# EasyEDA Pro project ProPrj_Syndra Version 2_2026-02-07.epro, board PCB2
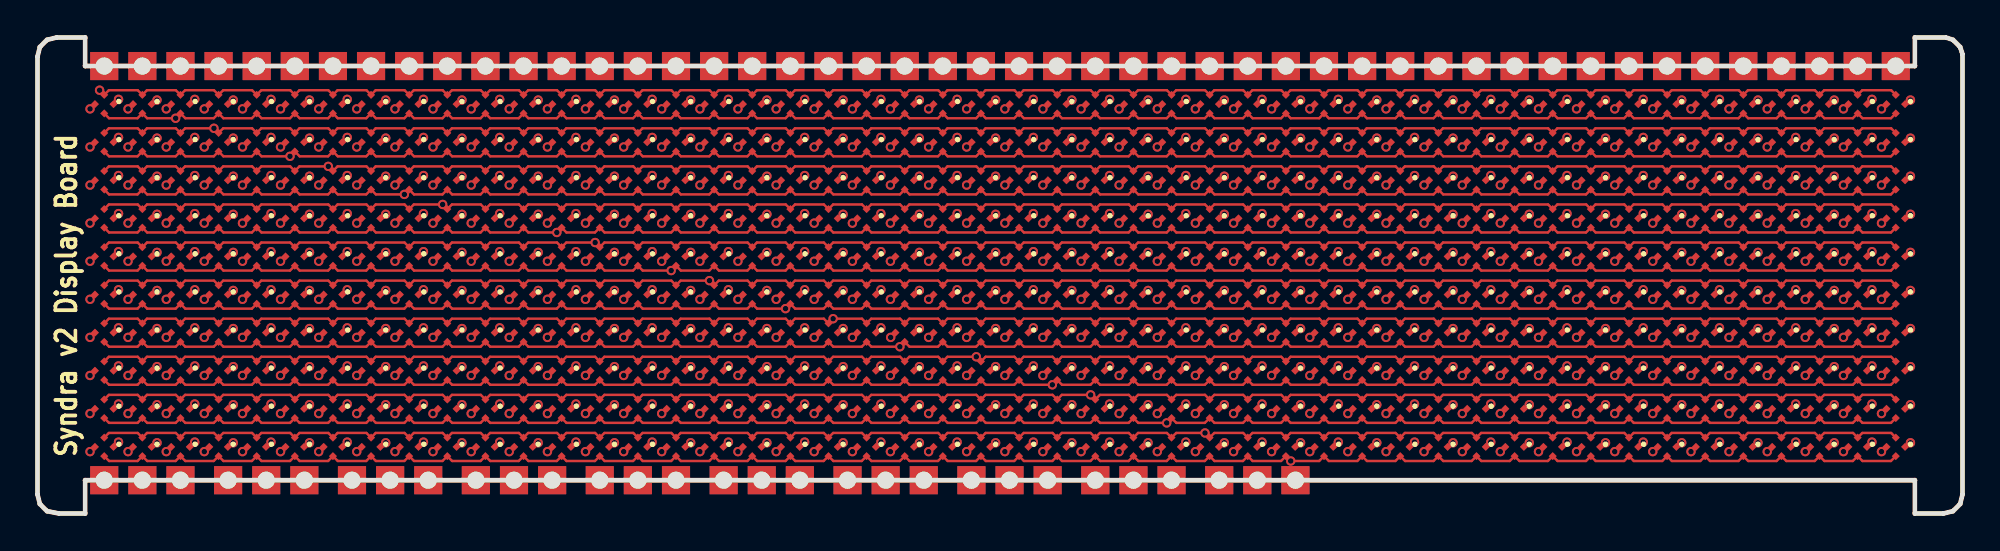
[diagram p2: board, top side]
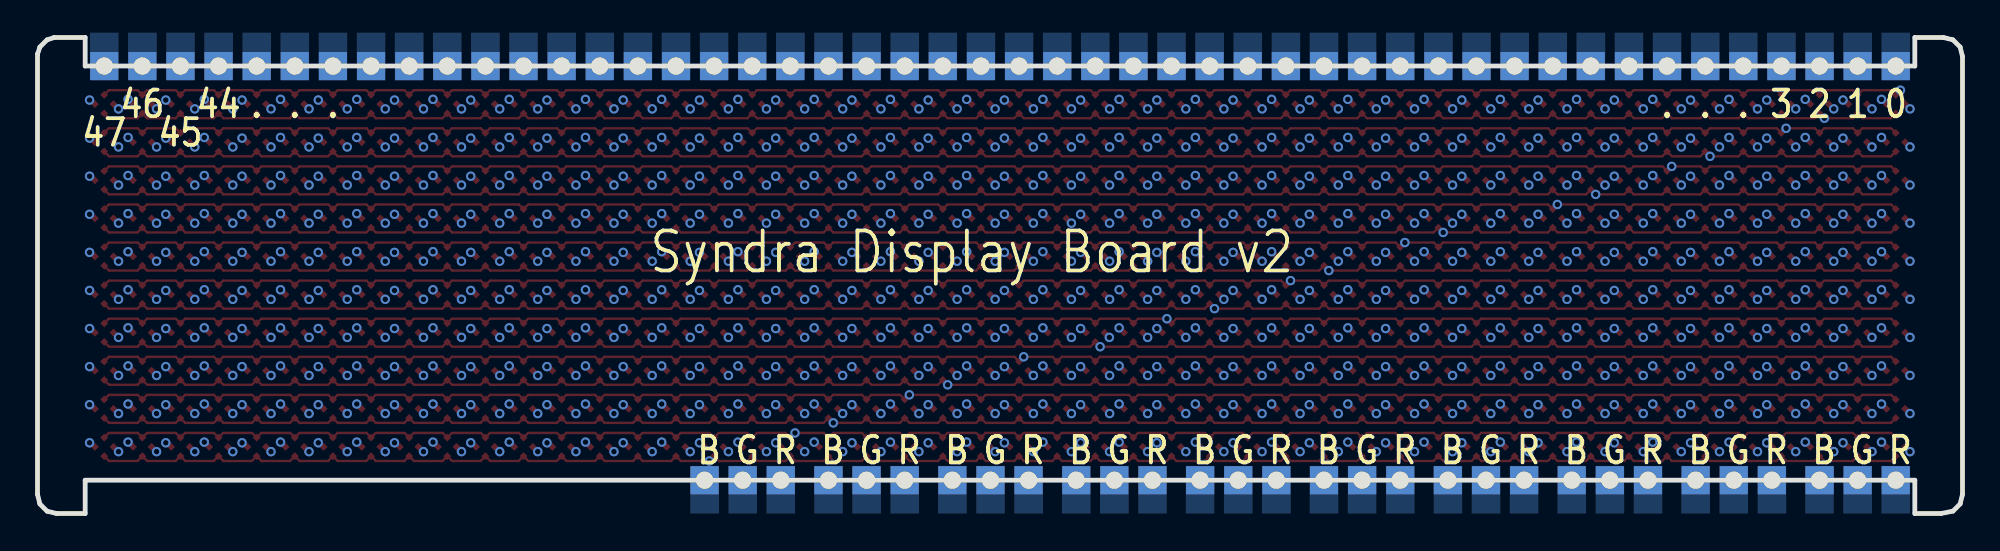
[diagram p3: board, bottom side, seen from below]

Outline 102.62 x 25.4 mm; copper layers: Top Layer, Inner1, Inner2, Bottom Layer. Coordinates in mm from the lower left corner of the outline.
Outline path: 0,24.38 0,1.02 0.13,0.51 0.51,0.13 1.14,0 2.54,0 2.54,1.78 100.08,1.78 100.08,0 101.6,0 102.11,0.13 102.49,0.51 102.62,1.02 102.62,24.51 102.49,24.89 102.11,25.27 101.73,25.4 100.08,25.4 100.08,23.88 2.54,23.88 2.54,25.4 1.02,25.4 0.51,25.27 0.13,24.89 0,24.38
Stack: Top Layer 0.035mm Outer layer thickness 1oz / Dielectric1 0.2104mm 7628 RC49% 8.6mil / Inner1 0.0152mm Inner layer thickness / Dielectric2 1.065mm 1.1mm H/HOZ Copper / Inner2 0.0152mm Inner layer thickness / Dielectric3 0.2104mm 7628 RC49% 8.6mil / Bottom Layer 0.035mm Outer layer thickness 1oz

## Design rules (mm)
template: JLCPCB Capability(Two Layers Board)
spacing copperThickness1oz (default): track to track 0.102, other pairs 0.152 to 0.3
spacing copperThickness2oz: track to track 0.203, other pairs 0.152 to 0.3
track width copperThickness1oz (default): min 0.127, default 0.254, max 2.54
track width copperThickness2oz: min 0.203, default 0.254, max 2.54
differential pair differentialPair (default): width min 0.127, default 0.254, max 2.54; gap min 0.152, default 0.152
via viaSize (default): diameter min 0.5, default 0.61, max 10; hole min 0.3, default 0.305, max 6.3

## Placement (name value [footprint] x y rotation side)
LED1  FC-B1010RGBT-HG  [LED-ARRAY-SMD_4P-L1.0-W1.0-TR-RD]  3.56 21.84 315 top
LED2  FC-B1010RGBT-HG  [LED-ARRAY-SMD_4P-L1.0-W1.0-TR-RD]  5.59 21.84 315 top
LED3  FC-B1010RGBT-HG  [LED-ARRAY-SMD_4P-L1.0-W1.0-TR-RD]  7.62 21.84 315 top
LED4  FC-B1010RGBT-HG  [LED-ARRAY-SMD_4P-L1.0-W1.0-TR-RD]  9.65 21.84 315 top
LED5  FC-B1010RGBT-HG  [LED-ARRAY-SMD_4P-L1.0-W1.0-TR-RD]  11.68 21.84 315 top
LED6  FC-B1010RGBT-HG  [LED-ARRAY-SMD_4P-L1.0-W1.0-TR-RD]  13.72 21.84 315 top
LED7  FC-B1010RGBT-HG  [LED-ARRAY-SMD_4P-L1.0-W1.0-TR-RD]  15.75 21.84 315 top
LED8  FC-B1010RGBT-HG  [LED-ARRAY-SMD_4P-L1.0-W1.0-TR-RD]  17.78 21.84 315 top
LED9  FC-B1010RGBT-HG  [LED-ARRAY-SMD_4P-L1.0-W1.0-TR-RD]  19.81 21.84 315 top
LED10  FC-B1010RGBT-HG  [LED-ARRAY-SMD_4P-L1.0-W1.0-TR-RD]  21.84 21.84 315 top
LED11  FC-B1010RGBT-HG  [LED-ARRAY-SMD_4P-L1.0-W1.0-TR-RD]  23.88 21.84 315 top
LED12  FC-B1010RGBT-HG  [LED-ARRAY-SMD_4P-L1.0-W1.0-TR-RD]  25.91 21.84 315 top
LED13  FC-B1010RGBT-HG  [LED-ARRAY-SMD_4P-L1.0-W1.0-TR-RD]  27.94 21.84 315 top
LED14  FC-B1010RGBT-HG  [LED-ARRAY-SMD_4P-L1.0-W1.0-TR-RD]  29.97 21.84 315 top
LED15  FC-B1010RGBT-HG  [LED-ARRAY-SMD_4P-L1.0-W1.0-TR-RD]  32 21.84 315 top
LED16  FC-B1010RGBT-HG  [LED-ARRAY-SMD_4P-L1.0-W1.0-TR-RD]  34.04 21.84 315 top
LED17  FC-B1010RGBT-HG  [LED-ARRAY-SMD_4P-L1.0-W1.0-TR-RD]  36.07 21.84 315 top
LED18  FC-B1010RGBT-HG  [LED-ARRAY-SMD_4P-L1.0-W1.0-TR-RD]  38.1 21.84 315 top
LED19  FC-B1010RGBT-HG  [LED-ARRAY-SMD_4P-L1.0-W1.0-TR-RD]  40.13 21.84 315 top
LED20  FC-B1010RGBT-HG  [LED-ARRAY-SMD_4P-L1.0-W1.0-TR-RD]  42.16 21.84 315 top
LED21  FC-B1010RGBT-HG  [LED-ARRAY-SMD_4P-L1.0-W1.0-TR-RD]  44.2 21.84 315 top
LED22  FC-B1010RGBT-HG  [LED-ARRAY-SMD_4P-L1.0-W1.0-TR-RD]  46.23 21.84 315 top
LED23  FC-B1010RGBT-HG  [LED-ARRAY-SMD_4P-L1.0-W1.0-TR-RD]  48.26 21.84 315 top
LED24  FC-B1010RGBT-HG  [LED-ARRAY-SMD_4P-L1.0-W1.0-TR-RD]  50.29 21.84 315 top
LED25  FC-B1010RGBT-HG  [LED-ARRAY-SMD_4P-L1.0-W1.0-TR-RD]  52.32 21.84 315 top
LED26  FC-B1010RGBT-HG  [LED-ARRAY-SMD_4P-L1.0-W1.0-TR-RD]  54.36 21.84 315 top
LED27  FC-B1010RGBT-HG  [LED-ARRAY-SMD_4P-L1.0-W1.0-TR-RD]  56.39 21.84 315 top
LED28  FC-B1010RGBT-HG  [LED-ARRAY-SMD_4P-L1.0-W1.0-TR-RD]  58.42 21.84 315 top
LED29  FC-B1010RGBT-HG  [LED-ARRAY-SMD_4P-L1.0-W1.0-TR-RD]  60.45 21.84 315 top
LED30  FC-B1010RGBT-HG  [LED-ARRAY-SMD_4P-L1.0-W1.0-TR-RD]  62.48 21.84 315 top
LED31  FC-B1010RGBT-HG  [LED-ARRAY-SMD_4P-L1.0-W1.0-TR-RD]  64.52 21.84 315 top
LED32  FC-B1010RGBT-HG  [LED-ARRAY-SMD_4P-L1.0-W1.0-TR-RD]  66.55 21.84 315 top
LED33  FC-B1010RGBT-HG  [LED-ARRAY-SMD_4P-L1.0-W1.0-TR-RD]  68.58 21.84 315 top
LED34  FC-B1010RGBT-HG  [LED-ARRAY-SMD_4P-L1.0-W1.0-TR-RD]  70.61 21.84 315 top
LED35  FC-B1010RGBT-HG  [LED-ARRAY-SMD_4P-L1.0-W1.0-TR-RD]  72.64 21.84 315 top
LED36  FC-B1010RGBT-HG  [LED-ARRAY-SMD_4P-L1.0-W1.0-TR-RD]  74.68 21.84 315 top
LED37  FC-B1010RGBT-HG  [LED-ARRAY-SMD_4P-L1.0-W1.0-TR-RD]  76.71 21.84 315 top
LED38  FC-B1010RGBT-HG  [LED-ARRAY-SMD_4P-L1.0-W1.0-TR-RD]  78.74 21.84 315 top
LED39  FC-B1010RGBT-HG  [LED-ARRAY-SMD_4P-L1.0-W1.0-TR-RD]  80.77 21.84 315 top
LED40  FC-B1010RGBT-HG  [LED-ARRAY-SMD_4P-L1.0-W1.0-TR-RD]  82.8 21.84 315 top
LED41  FC-B1010RGBT-HG  [LED-ARRAY-SMD_4P-L1.0-W1.0-TR-RD]  84.84 21.84 315 top
LED42  FC-B1010RGBT-HG  [LED-ARRAY-SMD_4P-L1.0-W1.0-TR-RD]  86.87 21.84 315 top
LED43  FC-B1010RGBT-HG  [LED-ARRAY-SMD_4P-L1.0-W1.0-TR-RD]  88.9 21.84 315 top
LED44  FC-B1010RGBT-HG  [LED-ARRAY-SMD_4P-L1.0-W1.0-TR-RD]  90.93 21.84 315 top
LED45  FC-B1010RGBT-HG  [LED-ARRAY-SMD_4P-L1.0-W1.0-TR-RD]  92.96 21.84 315 top
LED46  FC-B1010RGBT-HG  [LED-ARRAY-SMD_4P-L1.0-W1.0-TR-RD]  95 21.84 315 top
LED47  FC-B1010RGBT-HG  [LED-ARRAY-SMD_4P-L1.0-W1.0-TR-RD]  97.03 21.84 315 top
LED48  FC-B1010RGBT-HG  [LED-ARRAY-SMD_4P-L1.0-W1.0-TR-RD]  99.06 21.84 315 top
LED49  FC-B1010RGBT-HG  [LED-ARRAY-SMD_4P-L1.0-W1.0-TR-RD]  3.56 19.81 315 top
LED50  FC-B1010RGBT-HG  [LED-ARRAY-SMD_4P-L1.0-W1.0-TR-RD]  5.59 19.81 315 top
LED51  FC-B1010RGBT-HG  [LED-ARRAY-SMD_4P-L1.0-W1.0-TR-RD]  7.62 19.81 315 top
LED52  FC-B1010RGBT-HG  [LED-ARRAY-SMD_4P-L1.0-W1.0-TR-RD]  9.65 19.81 315 top
LED53  FC-B1010RGBT-HG  [LED-ARRAY-SMD_4P-L1.0-W1.0-TR-RD]  11.68 19.81 315 top
LED54  FC-B1010RGBT-HG  [LED-ARRAY-SMD_4P-L1.0-W1.0-TR-RD]  13.72 19.81 315 top
LED55  FC-B1010RGBT-HG  [LED-ARRAY-SMD_4P-L1.0-W1.0-TR-RD]  15.75 19.81 315 top
LED56  FC-B1010RGBT-HG  [LED-ARRAY-SMD_4P-L1.0-W1.0-TR-RD]  17.78 19.81 315 top
LED57  FC-B1010RGBT-HG  [LED-ARRAY-SMD_4P-L1.0-W1.0-TR-RD]  19.81 19.81 315 top
LED58  FC-B1010RGBT-HG  [LED-ARRAY-SMD_4P-L1.0-W1.0-TR-RD]  21.84 19.81 315 top
LED59  FC-B1010RGBT-HG  [LED-ARRAY-SMD_4P-L1.0-W1.0-TR-RD]  23.88 19.81 315 top
LED60  FC-B1010RGBT-HG  [LED-ARRAY-SMD_4P-L1.0-W1.0-TR-RD]  25.91 19.81 315 top
LED61  FC-B1010RGBT-HG  [LED-ARRAY-SMD_4P-L1.0-W1.0-TR-RD]  27.94 19.81 315 top
LED62  FC-B1010RGBT-HG  [LED-ARRAY-SMD_4P-L1.0-W1.0-TR-RD]  29.97 19.81 315 top
LED63  FC-B1010RGBT-HG  [LED-ARRAY-SMD_4P-L1.0-W1.0-TR-RD]  32 19.81 315 top
LED64  FC-B1010RGBT-HG  [LED-ARRAY-SMD_4P-L1.0-W1.0-TR-RD]  34.04 19.81 315 top
LED65  FC-B1010RGBT-HG  [LED-ARRAY-SMD_4P-L1.0-W1.0-TR-RD]  36.07 19.81 315 top
LED66  FC-B1010RGBT-HG  [LED-ARRAY-SMD_4P-L1.0-W1.0-TR-RD]  38.1 19.81 315 top
LED67  FC-B1010RGBT-HG  [LED-ARRAY-SMD_4P-L1.0-W1.0-TR-RD]  40.13 19.81 315 top
LED68  FC-B1010RGBT-HG  [LED-ARRAY-SMD_4P-L1.0-W1.0-TR-RD]  42.16 19.81 315 top
LED69  FC-B1010RGBT-HG  [LED-ARRAY-SMD_4P-L1.0-W1.0-TR-RD]  44.2 19.81 315 top
LED70  FC-B1010RGBT-HG  [LED-ARRAY-SMD_4P-L1.0-W1.0-TR-RD]  46.23 19.81 315 top
LED71  FC-B1010RGBT-HG  [LED-ARRAY-SMD_4P-L1.0-W1.0-TR-RD]  48.26 19.81 315 top
LED72  FC-B1010RGBT-HG  [LED-ARRAY-SMD_4P-L1.0-W1.0-TR-RD]  50.29 19.81 315 top
LED73  FC-B1010RGBT-HG  [LED-ARRAY-SMD_4P-L1.0-W1.0-TR-RD]  52.32 19.81 315 top
LED74  FC-B1010RGBT-HG  [LED-ARRAY-SMD_4P-L1.0-W1.0-TR-RD]  54.36 19.81 315 top
LED75  FC-B1010RGBT-HG  [LED-ARRAY-SMD_4P-L1.0-W1.0-TR-RD]  56.39 19.81 315 top
LED76  FC-B1010RGBT-HG  [LED-ARRAY-SMD_4P-L1.0-W1.0-TR-RD]  58.42 19.81 315 top
LED77  FC-B1010RGBT-HG  [LED-ARRAY-SMD_4P-L1.0-W1.0-TR-RD]  60.45 19.81 315 top
LED78  FC-B1010RGBT-HG  [LED-ARRAY-SMD_4P-L1.0-W1.0-TR-RD]  62.48 19.81 315 top
LED79  FC-B1010RGBT-HG  [LED-ARRAY-SMD_4P-L1.0-W1.0-TR-RD]  64.52 19.81 315 top
LED80  FC-B1010RGBT-HG  [LED-ARRAY-SMD_4P-L1.0-W1.0-TR-RD]  66.55 19.81 315 top
LED81  FC-B1010RGBT-HG  [LED-ARRAY-SMD_4P-L1.0-W1.0-TR-RD]  68.58 19.81 315 top
LED82  FC-B1010RGBT-HG  [LED-ARRAY-SMD_4P-L1.0-W1.0-TR-RD]  70.61 19.81 315 top
LED83  FC-B1010RGBT-HG  [LED-ARRAY-SMD_4P-L1.0-W1.0-TR-RD]  72.64 19.81 315 top
LED84  FC-B1010RGBT-HG  [LED-ARRAY-SMD_4P-L1.0-W1.0-TR-RD]  74.68 19.81 315 top
LED85  FC-B1010RGBT-HG  [LED-ARRAY-SMD_4P-L1.0-W1.0-TR-RD]  76.71 19.81 315 top
LED86  FC-B1010RGBT-HG  [LED-ARRAY-SMD_4P-L1.0-W1.0-TR-RD]  78.74 19.81 315 top
LED87  FC-B1010RGBT-HG  [LED-ARRAY-SMD_4P-L1.0-W1.0-TR-RD]  80.77 19.81 315 top
LED88  FC-B1010RGBT-HG  [LED-ARRAY-SMD_4P-L1.0-W1.0-TR-RD]  82.8 19.81 315 top
LED89  FC-B1010RGBT-HG  [LED-ARRAY-SMD_4P-L1.0-W1.0-TR-RD]  84.84 19.81 315 top
LED90  FC-B1010RGBT-HG  [LED-ARRAY-SMD_4P-L1.0-W1.0-TR-RD]  86.87 19.81 315 top
LED91  FC-B1010RGBT-HG  [LED-ARRAY-SMD_4P-L1.0-W1.0-TR-RD]  88.9 19.81 315 top
LED92  FC-B1010RGBT-HG  [LED-ARRAY-SMD_4P-L1.0-W1.0-TR-RD]  90.93 19.81 315 top
LED93  FC-B1010RGBT-HG  [LED-ARRAY-SMD_4P-L1.0-W1.0-TR-RD]  92.96 19.81 315 top
LED94  FC-B1010RGBT-HG  [LED-ARRAY-SMD_4P-L1.0-W1.0-TR-RD]  95 19.81 315 top
LED95  FC-B1010RGBT-HG  [LED-ARRAY-SMD_4P-L1.0-W1.0-TR-RD]  97.03 19.81 315 top
LED96  FC-B1010RGBT-HG  [LED-ARRAY-SMD_4P-L1.0-W1.0-TR-RD]  99.06 19.81 315 top
LED97  FC-B1010RGBT-HG  [LED-ARRAY-SMD_4P-L1.0-W1.0-TR-RD]  3.56 17.78 315 top
LED98  FC-B1010RGBT-HG  [LED-ARRAY-SMD_4P-L1.0-W1.0-TR-RD]  5.59 17.78 315 top
LED99  FC-B1010RGBT-HG  [LED-ARRAY-SMD_4P-L1.0-W1.0-TR-RD]  7.62 17.78 315 top
LED100  FC-B1010RGBT-HG  [LED-ARRAY-SMD_4P-L1.0-W1.0-TR-RD]  9.65 17.78 315 top
LED101  FC-B1010RGBT-HG  [LED-ARRAY-SMD_4P-L1.0-W1.0-TR-RD]  11.68 17.78 315 top
LED102  FC-B1010RGBT-HG  [LED-ARRAY-SMD_4P-L1.0-W1.0-TR-RD]  13.72 17.78 315 top
LED103  FC-B1010RGBT-HG  [LED-ARRAY-SMD_4P-L1.0-W1.0-TR-RD]  15.75 17.78 315 top
LED104  FC-B1010RGBT-HG  [LED-ARRAY-SMD_4P-L1.0-W1.0-TR-RD]  17.78 17.78 315 top
LED105  FC-B1010RGBT-HG  [LED-ARRAY-SMD_4P-L1.0-W1.0-TR-RD]  19.81 17.78 315 top
LED106  FC-B1010RGBT-HG  [LED-ARRAY-SMD_4P-L1.0-W1.0-TR-RD]  21.84 17.78 315 top
LED107  FC-B1010RGBT-HG  [LED-ARRAY-SMD_4P-L1.0-W1.0-TR-RD]  23.88 17.78 315 top
LED108  FC-B1010RGBT-HG  [LED-ARRAY-SMD_4P-L1.0-W1.0-TR-RD]  25.91 17.78 315 top
LED109  FC-B1010RGBT-HG  [LED-ARRAY-SMD_4P-L1.0-W1.0-TR-RD]  27.94 17.78 315 top
LED110  FC-B1010RGBT-HG  [LED-ARRAY-SMD_4P-L1.0-W1.0-TR-RD]  29.97 17.78 315 top
LED111  FC-B1010RGBT-HG  [LED-ARRAY-SMD_4P-L1.0-W1.0-TR-RD]  32 17.78 315 top
LED112  FC-B1010RGBT-HG  [LED-ARRAY-SMD_4P-L1.0-W1.0-TR-RD]  34.04 17.78 315 top
LED113  FC-B1010RGBT-HG  [LED-ARRAY-SMD_4P-L1.0-W1.0-TR-RD]  36.07 17.78 315 top
LED114  FC-B1010RGBT-HG  [LED-ARRAY-SMD_4P-L1.0-W1.0-TR-RD]  38.1 17.78 315 top
LED115  FC-B1010RGBT-HG  [LED-ARRAY-SMD_4P-L1.0-W1.0-TR-RD]  40.13 17.78 315 top
LED116  FC-B1010RGBT-HG  [LED-ARRAY-SMD_4P-L1.0-W1.0-TR-RD]  42.16 17.78 315 top
LED117  FC-B1010RGBT-HG  [LED-ARRAY-SMD_4P-L1.0-W1.0-TR-RD]  44.2 17.78 315 top
LED118  FC-B1010RGBT-HG  [LED-ARRAY-SMD_4P-L1.0-W1.0-TR-RD]  46.23 17.78 315 top
LED119  FC-B1010RGBT-HG  [LED-ARRAY-SMD_4P-L1.0-W1.0-TR-RD]  48.26 17.78 315 top
LED120  FC-B1010RGBT-HG  [LED-ARRAY-SMD_4P-L1.0-W1.0-TR-RD]  50.29 17.78 315 top
LED121  FC-B1010RGBT-HG  [LED-ARRAY-SMD_4P-L1.0-W1.0-TR-RD]  52.32 17.78 315 top
LED122  FC-B1010RGBT-HG  [LED-ARRAY-SMD_4P-L1.0-W1.0-TR-RD]  54.36 17.78 315 top
LED123  FC-B1010RGBT-HG  [LED-ARRAY-SMD_4P-L1.0-W1.0-TR-RD]  56.39 17.78 315 top
LED124  FC-B1010RGBT-HG  [LED-ARRAY-SMD_4P-L1.0-W1.0-TR-RD]  58.42 17.78 315 top
LED125  FC-B1010RGBT-HG  [LED-ARRAY-SMD_4P-L1.0-W1.0-TR-RD]  60.45 17.78 315 top
LED126  FC-B1010RGBT-HG  [LED-ARRAY-SMD_4P-L1.0-W1.0-TR-RD]  62.48 17.78 315 top
LED127  FC-B1010RGBT-HG  [LED-ARRAY-SMD_4P-L1.0-W1.0-TR-RD]  64.52 17.78 315 top
LED128  FC-B1010RGBT-HG  [LED-ARRAY-SMD_4P-L1.0-W1.0-TR-RD]  66.55 17.78 315 top
LED129  FC-B1010RGBT-HG  [LED-ARRAY-SMD_4P-L1.0-W1.0-TR-RD]  68.58 17.78 315 top
LED130  FC-B1010RGBT-HG  [LED-ARRAY-SMD_4P-L1.0-W1.0-TR-RD]  70.61 17.78 315 top
LED131  FC-B1010RGBT-HG  [LED-ARRAY-SMD_4P-L1.0-W1.0-TR-RD]  72.64 17.78 315 top
LED132  FC-B1010RGBT-HG  [LED-ARRAY-SMD_4P-L1.0-W1.0-TR-RD]  74.68 17.78 315 top
LED133  FC-B1010RGBT-HG  [LED-ARRAY-SMD_4P-L1.0-W1.0-TR-RD]  76.71 17.78 315 top
LED134  FC-B1010RGBT-HG  [LED-ARRAY-SMD_4P-L1.0-W1.0-TR-RD]  78.74 17.78 315 top
LED135  FC-B1010RGBT-HG  [LED-ARRAY-SMD_4P-L1.0-W1.0-TR-RD]  80.77 17.78 315 top
LED136  FC-B1010RGBT-HG  [LED-ARRAY-SMD_4P-L1.0-W1.0-TR-RD]  82.8 17.78 315 top
LED137  FC-B1010RGBT-HG  [LED-ARRAY-SMD_4P-L1.0-W1.0-TR-RD]  84.84 17.78 315 top
LED138  FC-B1010RGBT-HG  [LED-ARRAY-SMD_4P-L1.0-W1.0-TR-RD]  86.87 17.78 315 top
LED139  FC-B1010RGBT-HG  [LED-ARRAY-SMD_4P-L1.0-W1.0-TR-RD]  88.9 17.78 315 top
LED140  FC-B1010RGBT-HG  [LED-ARRAY-SMD_4P-L1.0-W1.0-TR-RD]  90.93 17.78 315 top
LED141  FC-B1010RGBT-HG  [LED-ARRAY-SMD_4P-L1.0-W1.0-TR-RD]  92.96 17.78 315 top
LED142  FC-B1010RGBT-HG  [LED-ARRAY-SMD_4P-L1.0-W1.0-TR-RD]  95 17.78 315 top
LED143  FC-B1010RGBT-HG  [LED-ARRAY-SMD_4P-L1.0-W1.0-TR-RD]  97.03 17.78 315 top
LED144  FC-B1010RGBT-HG  [LED-ARRAY-SMD_4P-L1.0-W1.0-TR-RD]  99.06 17.78 315 top
LED145  FC-B1010RGBT-HG  [LED-ARRAY-SMD_4P-L1.0-W1.0-TR-RD]  3.56 15.75 315 top
LED146  FC-B1010RGBT-HG  [LED-ARRAY-SMD_4P-L1.0-W1.0-TR-RD]  5.59 15.75 315 top
LED147  FC-B1010RGBT-HG  [LED-ARRAY-SMD_4P-L1.0-W1.0-TR-RD]  7.62 15.75 315 top
LED148  FC-B1010RGBT-HG  [LED-ARRAY-SMD_4P-L1.0-W1.0-TR-RD]  9.65 15.75 315 top
LED149  FC-B1010RGBT-HG  [LED-ARRAY-SMD_4P-L1.0-W1.0-TR-RD]  11.68 15.75 315 top
LED150  FC-B1010RGBT-HG  [LED-ARRAY-SMD_4P-L1.0-W1.0-TR-RD]  13.72 15.75 315 top
LED151  FC-B1010RGBT-HG  [LED-ARRAY-SMD_4P-L1.0-W1.0-TR-RD]  15.75 15.75 315 top
LED152  FC-B1010RGBT-HG  [LED-ARRAY-SMD_4P-L1.0-W1.0-TR-RD]  17.78 15.75 315 top
LED153  FC-B1010RGBT-HG  [LED-ARRAY-SMD_4P-L1.0-W1.0-TR-RD]  19.81 15.75 315 top
LED154  FC-B1010RGBT-HG  [LED-ARRAY-SMD_4P-L1.0-W1.0-TR-RD]  21.84 15.75 315 top
LED155  FC-B1010RGBT-HG  [LED-ARRAY-SMD_4P-L1.0-W1.0-TR-RD]  23.88 15.75 315 top
LED156  FC-B1010RGBT-HG  [LED-ARRAY-SMD_4P-L1.0-W1.0-TR-RD]  25.91 15.75 315 top
LED157  FC-B1010RGBT-HG  [LED-ARRAY-SMD_4P-L1.0-W1.0-TR-RD]  27.94 15.75 315 top
LED158  FC-B1010RGBT-HG  [LED-ARRAY-SMD_4P-L1.0-W1.0-TR-RD]  29.97 15.75 315 top
LED159  FC-B1010RGBT-HG  [LED-ARRAY-SMD_4P-L1.0-W1.0-TR-RD]  32 15.75 315 top
LED160  FC-B1010RGBT-HG  [LED-ARRAY-SMD_4P-L1.0-W1.0-TR-RD]  34.04 15.75 315 top
LED161  FC-B1010RGBT-HG  [LED-ARRAY-SMD_4P-L1.0-W1.0-TR-RD]  36.07 15.75 315 top
LED162  FC-B1010RGBT-HG  [LED-ARRAY-SMD_4P-L1.0-W1.0-TR-RD]  38.1 15.75 315 top
LED163  FC-B1010RGBT-HG  [LED-ARRAY-SMD_4P-L1.0-W1.0-TR-RD]  40.13 15.75 315 top
LED164  FC-B1010RGBT-HG  [LED-ARRAY-SMD_4P-L1.0-W1.0-TR-RD]  42.16 15.75 315 top
LED165  FC-B1010RGBT-HG  [LED-ARRAY-SMD_4P-L1.0-W1.0-TR-RD]  44.2 15.75 315 top
LED166  FC-B1010RGBT-HG  [LED-ARRAY-SMD_4P-L1.0-W1.0-TR-RD]  46.23 15.75 315 top
LED167  FC-B1010RGBT-HG  [LED-ARRAY-SMD_4P-L1.0-W1.0-TR-RD]  48.26 15.75 315 top
LED168  FC-B1010RGBT-HG  [LED-ARRAY-SMD_4P-L1.0-W1.0-TR-RD]  50.29 15.75 315 top
LED169  FC-B1010RGBT-HG  [LED-ARRAY-SMD_4P-L1.0-W1.0-TR-RD]  52.32 15.75 315 top
LED170  FC-B1010RGBT-HG  [LED-ARRAY-SMD_4P-L1.0-W1.0-TR-RD]  54.36 15.75 315 top
LED171  FC-B1010RGBT-HG  [LED-ARRAY-SMD_4P-L1.0-W1.0-TR-RD]  56.39 15.75 315 top
LED172  FC-B1010RGBT-HG  [LED-ARRAY-SMD_4P-L1.0-W1.0-TR-RD]  58.42 15.75 315 top
LED173  FC-B1010RGBT-HG  [LED-ARRAY-SMD_4P-L1.0-W1.0-TR-RD]  60.45 15.75 315 top
LED174  FC-B1010RGBT-HG  [LED-ARRAY-SMD_4P-L1.0-W1.0-TR-RD]  62.48 15.75 315 top
LED175  FC-B1010RGBT-HG  [LED-ARRAY-SMD_4P-L1.0-W1.0-TR-RD]  64.52 15.75 315 top
LED176  FC-B1010RGBT-HG  [LED-ARRAY-SMD_4P-L1.0-W1.0-TR-RD]  66.55 15.75 315 top
LED177  FC-B1010RGBT-HG  [LED-ARRAY-SMD_4P-L1.0-W1.0-TR-RD]  68.58 15.75 315 top
LED178  FC-B1010RGBT-HG  [LED-ARRAY-SMD_4P-L1.0-W1.0-TR-RD]  70.61 15.75 315 top
LED179  FC-B1010RGBT-HG  [LED-ARRAY-SMD_4P-L1.0-W1.0-TR-RD]  72.64 15.75 315 top
LED180  FC-B1010RGBT-HG  [LED-ARRAY-SMD_4P-L1.0-W1.0-TR-RD]  74.68 15.75 315 top
LED181  FC-B1010RGBT-HG  [LED-ARRAY-SMD_4P-L1.0-W1.0-TR-RD]  76.71 15.75 315 top
LED182  FC-B1010RGBT-HG  [LED-ARRAY-SMD_4P-L1.0-W1.0-TR-RD]  78.74 15.75 315 top
LED183  FC-B1010RGBT-HG  [LED-ARRAY-SMD_4P-L1.0-W1.0-TR-RD]  80.77 15.75 315 top
LED184  FC-B1010RGBT-HG  [LED-ARRAY-SMD_4P-L1.0-W1.0-TR-RD]  82.8 15.75 315 top
LED185  FC-B1010RGBT-HG  [LED-ARRAY-SMD_4P-L1.0-W1.0-TR-RD]  84.84 15.75 315 top
LED186  FC-B1010RGBT-HG  [LED-ARRAY-SMD_4P-L1.0-W1.0-TR-RD]  86.87 15.75 315 top
LED187  FC-B1010RGBT-HG  [LED-ARRAY-SMD_4P-L1.0-W1.0-TR-RD]  88.9 15.75 315 top
LED188  FC-B1010RGBT-HG  [LED-ARRAY-SMD_4P-L1.0-W1.0-TR-RD]  90.93 15.75 315 top
LED189  FC-B1010RGBT-HG  [LED-ARRAY-SMD_4P-L1.0-W1.0-TR-RD]  92.96 15.75 315 top
LED190  FC-B1010RGBT-HG  [LED-ARRAY-SMD_4P-L1.0-W1.0-TR-RD]  95 15.75 315 top
LED191  FC-B1010RGBT-HG  [LED-ARRAY-SMD_4P-L1.0-W1.0-TR-RD]  97.03 15.75 315 top
LED192  FC-B1010RGBT-HG  [LED-ARRAY-SMD_4P-L1.0-W1.0-TR-RD]  99.06 15.75 315 top
LED193  FC-B1010RGBT-HG  [LED-ARRAY-SMD_4P-L1.0-W1.0-TR-RD]  3.56 13.72 315 top
LED194  FC-B1010RGBT-HG  [LED-ARRAY-SMD_4P-L1.0-W1.0-TR-RD]  5.59 13.72 315 top
LED195  FC-B1010RGBT-HG  [LED-ARRAY-SMD_4P-L1.0-W1.0-TR-RD]  7.62 13.72 315 top
LED196  FC-B1010RGBT-HG  [LED-ARRAY-SMD_4P-L1.0-W1.0-TR-RD]  9.65 13.72 315 top
LED197  FC-B1010RGBT-HG  [LED-ARRAY-SMD_4P-L1.0-W1.0-TR-RD]  11.68 13.72 315 top
LED198  FC-B1010RGBT-HG  [LED-ARRAY-SMD_4P-L1.0-W1.0-TR-RD]  13.72 13.72 315 top
LED199  FC-B1010RGBT-HG  [LED-ARRAY-SMD_4P-L1.0-W1.0-TR-RD]  15.75 13.72 315 top
LED200  FC-B1010RGBT-HG  [LED-ARRAY-SMD_4P-L1.0-W1.0-TR-RD]  17.78 13.72 315 top
LED201  FC-B1010RGBT-HG  [LED-ARRAY-SMD_4P-L1.0-W1.0-TR-RD]  19.81 13.72 315 top
LED202  FC-B1010RGBT-HG  [LED-ARRAY-SMD_4P-L1.0-W1.0-TR-RD]  21.84 13.72 315 top
LED203  FC-B1010RGBT-HG  [LED-ARRAY-SMD_4P-L1.0-W1.0-TR-RD]  23.88 13.72 315 top
LED204  FC-B1010RGBT-HG  [LED-ARRAY-SMD_4P-L1.0-W1.0-TR-RD]  25.91 13.72 315 top
LED205  FC-B1010RGBT-HG  [LED-ARRAY-SMD_4P-L1.0-W1.0-TR-RD]  27.94 13.72 315 top
LED206  FC-B1010RGBT-HG  [LED-ARRAY-SMD_4P-L1.0-W1.0-TR-RD]  29.97 13.72 315 top
LED207  FC-B1010RGBT-HG  [LED-ARRAY-SMD_4P-L1.0-W1.0-TR-RD]  32 13.72 315 top
LED208  FC-B1010RGBT-HG  [LED-ARRAY-SMD_4P-L1.0-W1.0-TR-RD]  34.04 13.72 315 top
LED209  FC-B1010RGBT-HG  [LED-ARRAY-SMD_4P-L1.0-W1.0-TR-RD]  36.07 13.72 315 top
LED210  FC-B1010RGBT-HG  [LED-ARRAY-SMD_4P-L1.0-W1.0-TR-RD]  38.1 13.72 315 top
LED211  FC-B1010RGBT-HG  [LED-ARRAY-SMD_4P-L1.0-W1.0-TR-RD]  40.13 13.72 315 top
LED212  FC-B1010RGBT-HG  [LED-ARRAY-SMD_4P-L1.0-W1.0-TR-RD]  42.16 13.72 315 top
LED213  FC-B1010RGBT-HG  [LED-ARRAY-SMD_4P-L1.0-W1.0-TR-RD]  44.2 13.72 315 top
LED214  FC-B1010RGBT-HG  [LED-ARRAY-SMD_4P-L1.0-W1.0-TR-RD]  46.23 13.72 315 top
LED215  FC-B1010RGBT-HG  [LED-ARRAY-SMD_4P-L1.0-W1.0-TR-RD]  48.26 13.72 315 top
LED216  FC-B1010RGBT-HG  [LED-ARRAY-SMD_4P-L1.0-W1.0-TR-RD]  50.29 13.72 315 top
LED217  FC-B1010RGBT-HG  [LED-ARRAY-SMD_4P-L1.0-W1.0-TR-RD]  52.32 13.72 315 top
LED218  FC-B1010RGBT-HG  [LED-ARRAY-SMD_4P-L1.0-W1.0-TR-RD]  54.36 13.72 315 top
LED219  FC-B1010RGBT-HG  [LED-ARRAY-SMD_4P-L1.0-W1.0-TR-RD]  56.39 13.72 315 top
LED220  FC-B1010RGBT-HG  [LED-ARRAY-SMD_4P-L1.0-W1.0-TR-RD]  58.42 13.72 315 top
LED221  FC-B1010RGBT-HG  [LED-ARRAY-SMD_4P-L1.0-W1.0-TR-RD]  60.45 13.72 315 top
LED222  FC-B1010RGBT-HG  [LED-ARRAY-SMD_4P-L1.0-W1.0-TR-RD]  62.48 13.72 315 top
LED223  FC-B1010RGBT-HG  [LED-ARRAY-SMD_4P-L1.0-W1.0-TR-RD]  64.52 13.72 315 top
LED224  FC-B1010RGBT-HG  [LED-ARRAY-SMD_4P-L1.0-W1.0-TR-RD]  66.55 13.72 315 top
LED225  FC-B1010RGBT-HG  [LED-ARRAY-SMD_4P-L1.0-W1.0-TR-RD]  68.58 13.72 315 top
LED226  FC-B1010RGBT-HG  [LED-ARRAY-SMD_4P-L1.0-W1.0-TR-RD]  70.61 13.72 315 top
LED227  FC-B1010RGBT-HG  [LED-ARRAY-SMD_4P-L1.0-W1.0-TR-RD]  72.64 13.72 315 top
LED228  FC-B1010RGBT-HG  [LED-ARRAY-SMD_4P-L1.0-W1.0-TR-RD]  74.68 13.72 315 top
LED229  FC-B1010RGBT-HG  [LED-ARRAY-SMD_4P-L1.0-W1.0-TR-RD]  76.71 13.72 315 top
LED230  FC-B1010RGBT-HG  [LED-ARRAY-SMD_4P-L1.0-W1.0-TR-RD]  78.74 13.72 315 top
LED231  FC-B1010RGBT-HG  [LED-ARRAY-SMD_4P-L1.0-W1.0-TR-RD]  80.77 13.72 315 top
LED232  FC-B1010RGBT-HG  [LED-ARRAY-SMD_4P-L1.0-W1.0-TR-RD]  82.8 13.72 315 top
LED233  FC-B1010RGBT-HG  [LED-ARRAY-SMD_4P-L1.0-W1.0-TR-RD]  84.84 13.72 315 top
LED234  FC-B1010RGBT-HG  [LED-ARRAY-SMD_4P-L1.0-W1.0-TR-RD]  86.87 13.72 315 top
LED235  FC-B1010RGBT-HG  [LED-ARRAY-SMD_4P-L1.0-W1.0-TR-RD]  88.9 13.72 315 top
LED236  FC-B1010RGBT-HG  [LED-ARRAY-SMD_4P-L1.0-W1.0-TR-RD]  90.93 13.72 315 top
LED237  FC-B1010RGBT-HG  [LED-ARRAY-SMD_4P-L1.0-W1.0-TR-RD]  92.96 13.72 315 top
LED238  FC-B1010RGBT-HG  [LED-ARRAY-SMD_4P-L1.0-W1.0-TR-RD]  95 13.72 315 top
LED239  FC-B1010RGBT-HG  [LED-ARRAY-SMD_4P-L1.0-W1.0-TR-RD]  97.03 13.72 315 top
LED240  FC-B1010RGBT-HG  [LED-ARRAY-SMD_4P-L1.0-W1.0-TR-RD]  99.06 13.72 315 top
LED241  FC-B1010RGBT-HG  [LED-ARRAY-SMD_4P-L1.0-W1.0-TR-RD]  3.56 11.68 315 top
LED242  FC-B1010RGBT-HG  [LED-ARRAY-SMD_4P-L1.0-W1.0-TR-RD]  5.59 11.68 315 top
LED243  FC-B1010RGBT-HG  [LED-ARRAY-SMD_4P-L1.0-W1.0-TR-RD]  7.62 11.68 315 top
LED244  FC-B1010RGBT-HG  [LED-ARRAY-SMD_4P-L1.0-W1.0-TR-RD]  9.65 11.68 315 top
LED245  FC-B1010RGBT-HG  [LED-ARRAY-SMD_4P-L1.0-W1.0-TR-RD]  11.68 11.68 315 top
LED246  FC-B1010RGBT-HG  [LED-ARRAY-SMD_4P-L1.0-W1.0-TR-RD]  13.72 11.68 315 top
LED247  FC-B1010RGBT-HG  [LED-ARRAY-SMD_4P-L1.0-W1.0-TR-RD]  15.75 11.68 315 top
LED248  FC-B1010RGBT-HG  [LED-ARRAY-SMD_4P-L1.0-W1.0-TR-RD]  17.78 11.68 315 top
LED249  FC-B1010RGBT-HG  [LED-ARRAY-SMD_4P-L1.0-W1.0-TR-RD]  19.81 11.68 315 top
LED250  FC-B1010RGBT-HG  [LED-ARRAY-SMD_4P-L1.0-W1.0-TR-RD]  21.84 11.68 315 top
LED251  FC-B1010RGBT-HG  [LED-ARRAY-SMD_4P-L1.0-W1.0-TR-RD]  23.88 11.68 315 top
LED252  FC-B1010RGBT-HG  [LED-ARRAY-SMD_4P-L1.0-W1.0-TR-RD]  25.91 11.68 315 top
LED253  FC-B1010RGBT-HG  [LED-ARRAY-SMD_4P-L1.0-W1.0-TR-RD]  27.94 11.68 315 top
LED254  FC-B1010RGBT-HG  [LED-ARRAY-SMD_4P-L1.0-W1.0-TR-RD]  29.97 11.68 315 top
LED255  FC-B1010RGBT-HG  [LED-ARRAY-SMD_4P-L1.0-W1.0-TR-RD]  32 11.68 315 top
LED256  FC-B1010RGBT-HG  [LED-ARRAY-SMD_4P-L1.0-W1.0-TR-RD]  34.04 11.68 315 top
LED257  FC-B1010RGBT-HG  [LED-ARRAY-SMD_4P-L1.0-W1.0-TR-RD]  36.07 11.68 315 top
LED258  FC-B1010RGBT-HG  [LED-ARRAY-SMD_4P-L1.0-W1.0-TR-RD]  38.1 11.68 315 top
LED259  FC-B1010RGBT-HG  [LED-ARRAY-SMD_4P-L1.0-W1.0-TR-RD]  40.13 11.68 315 top
LED260  FC-B1010RGBT-HG  [LED-ARRAY-SMD_4P-L1.0-W1.0-TR-RD]  42.16 11.68 315 top
LED261  FC-B1010RGBT-HG  [LED-ARRAY-SMD_4P-L1.0-W1.0-TR-RD]  44.2 11.68 315 top
LED262  FC-B1010RGBT-HG  [LED-ARRAY-SMD_4P-L1.0-W1.0-TR-RD]  46.23 11.68 315 top
LED263  FC-B1010RGBT-HG  [LED-ARRAY-SMD_4P-L1.0-W1.0-TR-RD]  48.26 11.68 315 top
LED264  FC-B1010RGBT-HG  [LED-ARRAY-SMD_4P-L1.0-W1.0-TR-RD]  50.29 11.68 315 top
LED265  FC-B1010RGBT-HG  [LED-ARRAY-SMD_4P-L1.0-W1.0-TR-RD]  52.32 11.68 315 top
LED266  FC-B1010RGBT-HG  [LED-ARRAY-SMD_4P-L1.0-W1.0-TR-RD]  54.36 11.68 315 top
LED267  FC-B1010RGBT-HG  [LED-ARRAY-SMD_4P-L1.0-W1.0-TR-RD]  56.39 11.68 315 top
LED268  FC-B1010RGBT-HG  [LED-ARRAY-SMD_4P-L1.0-W1.0-TR-RD]  58.42 11.68 315 top
LED269  FC-B1010RGBT-HG  [LED-ARRAY-SMD_4P-L1.0-W1.0-TR-RD]  60.45 11.68 315 top
LED270  FC-B1010RGBT-HG  [LED-ARRAY-SMD_4P-L1.0-W1.0-TR-RD]  62.48 11.68 315 top
LED271  FC-B1010RGBT-HG  [LED-ARRAY-SMD_4P-L1.0-W1.0-TR-RD]  64.52 11.68 315 top
LED272  FC-B1010RGBT-HG  [LED-ARRAY-SMD_4P-L1.0-W1.0-TR-RD]  66.55 11.68 315 top
LED273  FC-B1010RGBT-HG  [LED-ARRAY-SMD_4P-L1.0-W1.0-TR-RD]  68.58 11.68 315 top
LED274  FC-B1010RGBT-HG  [LED-ARRAY-SMD_4P-L1.0-W1.0-TR-RD]  70.61 11.68 315 top
LED275  FC-B1010RGBT-HG  [LED-ARRAY-SMD_4P-L1.0-W1.0-TR-RD]  72.64 11.68 315 top
LED276  FC-B1010RGBT-HG  [LED-ARRAY-SMD_4P-L1.0-W1.0-TR-RD]  74.68 11.68 315 top
LED277  FC-B1010RGBT-HG  [LED-ARRAY-SMD_4P-L1.0-W1.0-TR-RD]  76.71 11.68 315 top
LED278  FC-B1010RGBT-HG  [LED-ARRAY-SMD_4P-L1.0-W1.0-TR-RD]  78.74 11.68 315 top
LED279  FC-B1010RGBT-HG  [LED-ARRAY-SMD_4P-L1.0-W1.0-TR-RD]  80.77 11.68 315 top
LED280  FC-B1010RGBT-HG  [LED-ARRAY-SMD_4P-L1.0-W1.0-TR-RD]  82.8 11.68 315 top
LED281  FC-B1010RGBT-HG  [LED-ARRAY-SMD_4P-L1.0-W1.0-TR-RD]  84.84 11.68 315 top
LED282  FC-B1010RGBT-HG  [LED-ARRAY-SMD_4P-L1.0-W1.0-TR-RD]  86.87 11.68 315 top
LED283  FC-B1010RGBT-HG  [LED-ARRAY-SMD_4P-L1.0-W1.0-TR-RD]  88.9 11.68 315 top
LED284  FC-B1010RGBT-HG  [LED-ARRAY-SMD_4P-L1.0-W1.0-TR-RD]  90.93 11.68 315 top
LED285  FC-B1010RGBT-HG  [LED-ARRAY-SMD_4P-L1.0-W1.0-TR-RD]  92.96 11.68 315 top
LED286  FC-B1010RGBT-HG  [LED-ARRAY-SMD_4P-L1.0-W1.0-TR-RD]  95 11.68 315 top
LED287  FC-B1010RGBT-HG  [LED-ARRAY-SMD_4P-L1.0-W1.0-TR-RD]  97.03 11.68 315 top
LED288  FC-B1010RGBT-HG  [LED-ARRAY-SMD_4P-L1.0-W1.0-TR-RD]  99.06 11.68 315 top
LED289  FC-B1010RGBT-HG  [LED-ARRAY-SMD_4P-L1.0-W1.0-TR-RD]  3.56 9.65 315 top
LED290  FC-B1010RGBT-HG  [LED-ARRAY-SMD_4P-L1.0-W1.0-TR-RD]  5.59 9.65 315 top
LED291  FC-B1010RGBT-HG  [LED-ARRAY-SMD_4P-L1.0-W1.0-TR-RD]  7.62 9.65 315 top
LED292  FC-B1010RGBT-HG  [LED-ARRAY-SMD_4P-L1.0-W1.0-TR-RD]  9.65 9.65 315 top
LED293  FC-B1010RGBT-HG  [LED-ARRAY-SMD_4P-L1.0-W1.0-TR-RD]  11.68 9.65 315 top
LED294  FC-B1010RGBT-HG  [LED-ARRAY-SMD_4P-L1.0-W1.0-TR-RD]  13.72 9.65 315 top
LED295  FC-B1010RGBT-HG  [LED-ARRAY-SMD_4P-L1.0-W1.0-TR-RD]  15.75 9.65 315 top
LED296  FC-B1010RGBT-HG  [LED-ARRAY-SMD_4P-L1.0-W1.0-TR-RD]  17.78 9.65 315 top
LED297  FC-B1010RGBT-HG  [LED-ARRAY-SMD_4P-L1.0-W1.0-TR-RD]  19.81 9.65 315 top
LED298  FC-B1010RGBT-HG  [LED-ARRAY-SMD_4P-L1.0-W1.0-TR-RD]  21.84 9.65 315 top
LED299  FC-B1010RGBT-HG  [LED-ARRAY-SMD_4P-L1.0-W1.0-TR-RD]  23.88 9.65 315 top
LED300  FC-B1010RGBT-HG  [LED-ARRAY-SMD_4P-L1.0-W1.0-TR-RD]  25.91 9.65 315 top
LED301  FC-B1010RGBT-HG  [LED-ARRAY-SMD_4P-L1.0-W1.0-TR-RD]  27.94 9.65 315 top
LED302  FC-B1010RGBT-HG  [LED-ARRAY-SMD_4P-L1.0-W1.0-TR-RD]  29.97 9.65 315 top
LED303  FC-B1010RGBT-HG  [LED-ARRAY-SMD_4P-L1.0-W1.0-TR-RD]  32 9.65 315 top
LED304  FC-B1010RGBT-HG  [LED-ARRAY-SMD_4P-L1.0-W1.0-TR-RD]  34.04 9.65 315 top
LED305  FC-B1010RGBT-HG  [LED-ARRAY-SMD_4P-L1.0-W1.0-TR-RD]  36.07 9.65 315 top
LED306  FC-B1010RGBT-HG  [LED-ARRAY-SMD_4P-L1.0-W1.0-TR-RD]  38.1 9.65 315 top
LED307  FC-B1010RGBT-HG  [LED-ARRAY-SMD_4P-L1.0-W1.0-TR-RD]  40.13 9.65 315 top
LED308  FC-B1010RGBT-HG  [LED-ARRAY-SMD_4P-L1.0-W1.0-TR-RD]  42.16 9.65 315 top
LED309  FC-B1010RGBT-HG  [LED-ARRAY-SMD_4P-L1.0-W1.0-TR-RD]  44.2 9.65 315 top
LED310  FC-B1010RGBT-HG  [LED-ARRAY-SMD_4P-L1.0-W1.0-TR-RD]  46.23 9.65 315 top
LED311  FC-B1010RGBT-HG  [LED-ARRAY-SMD_4P-L1.0-W1.0-TR-RD]  48.26 9.65 315 top
LED312  FC-B1010RGBT-HG  [LED-ARRAY-SMD_4P-L1.0-W1.0-TR-RD]  50.29 9.65 315 top
LED313  FC-B1010RGBT-HG  [LED-ARRAY-SMD_4P-L1.0-W1.0-TR-RD]  52.32 9.65 315 top
LED314  FC-B1010RGBT-HG  [LED-ARRAY-SMD_4P-L1.0-W1.0-TR-RD]  54.36 9.65 315 top
LED315  FC-B1010RGBT-HG  [LED-ARRAY-SMD_4P-L1.0-W1.0-TR-RD]  56.39 9.65 315 top
LED316  FC-B1010RGBT-HG  [LED-ARRAY-SMD_4P-L1.0-W1.0-TR-RD]  58.42 9.65 315 top
LED317  FC-B1010RGBT-HG  [LED-ARRAY-SMD_4P-L1.0-W1.0-TR-RD]  60.45 9.65 315 top
LED318  FC-B1010RGBT-HG  [LED-ARRAY-SMD_4P-L1.0-W1.0-TR-RD]  62.48 9.65 315 top
LED319  FC-B1010RGBT-HG  [LED-ARRAY-SMD_4P-L1.0-W1.0-TR-RD]  64.52 9.65 315 top
LED320  FC-B1010RGBT-HG  [LED-ARRAY-SMD_4P-L1.0-W1.0-TR-RD]  66.55 9.65 315 top
LED321  FC-B1010RGBT-HG  [LED-ARRAY-SMD_4P-L1.0-W1.0-TR-RD]  68.58 9.65 315 top
LED322  FC-B1010RGBT-HG  [LED-ARRAY-SMD_4P-L1.0-W1.0-TR-RD]  70.61 9.65 315 top
LED323  FC-B1010RGBT-HG  [LED-ARRAY-SMD_4P-L1.0-W1.0-TR-RD]  72.64 9.65 315 top
LED324  FC-B1010RGBT-HG  [LED-ARRAY-SMD_4P-L1.0-W1.0-TR-RD]  74.68 9.65 315 top
LED325  FC-B1010RGBT-HG  [LED-ARRAY-SMD_4P-L1.0-W1.0-TR-RD]  76.71 9.65 315 top
LED326  FC-B1010RGBT-HG  [LED-ARRAY-SMD_4P-L1.0-W1.0-TR-RD]  78.74 9.65 315 top
LED327  FC-B1010RGBT-HG  [LED-ARRAY-SMD_4P-L1.0-W1.0-TR-RD]  80.77 9.65 315 top
LED328  FC-B1010RGBT-HG  [LED-ARRAY-SMD_4P-L1.0-W1.0-TR-RD]  82.8 9.65 315 top
LED329  FC-B1010RGBT-HG  [LED-ARRAY-SMD_4P-L1.0-W1.0-TR-RD]  84.84 9.65 315 top
LED330  FC-B1010RGBT-HG  [LED-ARRAY-SMD_4P-L1.0-W1.0-TR-RD]  86.87 9.65 315 top
LED331  FC-B1010RGBT-HG  [LED-ARRAY-SMD_4P-L1.0-W1.0-TR-RD]  88.9 9.65 315 top
LED332  FC-B1010RGBT-HG  [LED-ARRAY-SMD_4P-L1.0-W1.0-TR-RD]  90.93 9.65 315 top
LED333  FC-B1010RGBT-HG  [LED-ARRAY-SMD_4P-L1.0-W1.0-TR-RD]  92.96 9.65 315 top
LED334  FC-B1010RGBT-HG  [LED-ARRAY-SMD_4P-L1.0-W1.0-TR-RD]  95 9.65 315 top
LED335  FC-B1010RGBT-HG  [LED-ARRAY-SMD_4P-L1.0-W1.0-TR-RD]  97.03 9.65 315 top
LED336  FC-B1010RGBT-HG  [LED-ARRAY-SMD_4P-L1.0-W1.0-TR-RD]  99.06 9.65 315 top
LED337  FC-B1010RGBT-HG  [LED-ARRAY-SMD_4P-L1.0-W1.0-TR-RD]  3.56 7.62 315 top
LED338  FC-B1010RGBT-HG  [LED-ARRAY-SMD_4P-L1.0-W1.0-TR-RD]  5.59 7.62 315 top
LED339  FC-B1010RGBT-HG  [LED-ARRAY-SMD_4P-L1.0-W1.0-TR-RD]  7.62 7.62 315 top
LED340  FC-B1010RGBT-HG  [LED-ARRAY-SMD_4P-L1.0-W1.0-TR-RD]  9.65 7.62 315 top
LED341  FC-B1010RGBT-HG  [LED-ARRAY-SMD_4P-L1.0-W1.0-TR-RD]  11.68 7.62 315 top
LED342  FC-B1010RGBT-HG  [LED-ARRAY-SMD_4P-L1.0-W1.0-TR-RD]  13.72 7.62 315 top
LED343  FC-B1010RGBT-HG  [LED-ARRAY-SMD_4P-L1.0-W1.0-TR-RD]  15.75 7.62 315 top
LED344  FC-B1010RGBT-HG  [LED-ARRAY-SMD_4P-L1.0-W1.0-TR-RD]  17.78 7.62 315 top
LED345  FC-B1010RGBT-HG  [LED-ARRAY-SMD_4P-L1.0-W1.0-TR-RD]  19.81 7.62 315 top
LED346  FC-B1010RGBT-HG  [LED-ARRAY-SMD_4P-L1.0-W1.0-TR-RD]  21.84 7.62 315 top
LED347  FC-B1010RGBT-HG  [LED-ARRAY-SMD_4P-L1.0-W1.0-TR-RD]  23.88 7.62 315 top
LED348  FC-B1010RGBT-HG  [LED-ARRAY-SMD_4P-L1.0-W1.0-TR-RD]  25.91 7.62 315 top
LED349  FC-B1010RGBT-HG  [LED-ARRAY-SMD_4P-L1.0-W1.0-TR-RD]  27.94 7.62 315 top
LED350  FC-B1010RGBT-HG  [LED-ARRAY-SMD_4P-L1.0-W1.0-TR-RD]  29.97 7.62 315 top
LED351  FC-B1010RGBT-HG  [LED-ARRAY-SMD_4P-L1.0-W1.0-TR-RD]  32 7.62 315 top
LED352  FC-B1010RGBT-HG  [LED-ARRAY-SMD_4P-L1.0-W1.0-TR-RD]  34.04 7.62 315 top
LED353  FC-B1010RGBT-HG  [LED-ARRAY-SMD_4P-L1.0-W1.0-TR-RD]  36.07 7.62 315 top
LED354  FC-B1010RGBT-HG  [LED-ARRAY-SMD_4P-L1.0-W1.0-TR-RD]  38.1 7.62 315 top
LED355  FC-B1010RGBT-HG  [LED-ARRAY-SMD_4P-L1.0-W1.0-TR-RD]  40.13 7.62 315 top
LED356  FC-B1010RGBT-HG  [LED-ARRAY-SMD_4P-L1.0-W1.0-TR-RD]  42.16 7.62 315 top
LED357  FC-B1010RGBT-HG  [LED-ARRAY-SMD_4P-L1.0-W1.0-TR-RD]  44.2 7.62 315 top
LED358  FC-B1010RGBT-HG  [LED-ARRAY-SMD_4P-L1.0-W1.0-TR-RD]  46.23 7.62 315 top
LED359  FC-B1010RGBT-HG  [LED-ARRAY-SMD_4P-L1.0-W1.0-TR-RD]  48.26 7.62 315 top
LED360  FC-B1010RGBT-HG  [LED-ARRAY-SMD_4P-L1.0-W1.0-TR-RD]  50.29 7.62 315 top
LED361  FC-B1010RGBT-HG  [LED-ARRAY-SMD_4P-L1.0-W1.0-TR-RD]  52.32 7.62 315 top
LED362  FC-B1010RGBT-HG  [LED-ARRAY-SMD_4P-L1.0-W1.0-TR-RD]  54.36 7.62 315 top
LED363  FC-B1010RGBT-HG  [LED-ARRAY-SMD_4P-L1.0-W1.0-TR-RD]  56.39 7.62 315 top
LED364  FC-B1010RGBT-HG  [LED-ARRAY-SMD_4P-L1.0-W1.0-TR-RD]  58.42 7.62 315 top
LED365  FC-B1010RGBT-HG  [LED-ARRAY-SMD_4P-L1.0-W1.0-TR-RD]  60.45 7.62 315 top
LED366  FC-B1010RGBT-HG  [LED-ARRAY-SMD_4P-L1.0-W1.0-TR-RD]  62.48 7.62 315 top
LED367  FC-B1010RGBT-HG  [LED-ARRAY-SMD_4P-L1.0-W1.0-TR-RD]  64.52 7.62 315 top
LED368  FC-B1010RGBT-HG  [LED-ARRAY-SMD_4P-L1.0-W1.0-TR-RD]  66.55 7.62 315 top
LED369  FC-B1010RGBT-HG  [LED-ARRAY-SMD_4P-L1.0-W1.0-TR-RD]  68.58 7.62 315 top
LED370  FC-B1010RGBT-HG  [LED-ARRAY-SMD_4P-L1.0-W1.0-TR-RD]  70.61 7.62 315 top
LED371  FC-B1010RGBT-HG  [LED-ARRAY-SMD_4P-L1.0-W1.0-TR-RD]  72.64 7.62 315 top
LED372  FC-B1010RGBT-HG  [LED-ARRAY-SMD_4P-L1.0-W1.0-TR-RD]  74.68 7.62 315 top
LED373  FC-B1010RGBT-HG  [LED-ARRAY-SMD_4P-L1.0-W1.0-TR-RD]  76.71 7.62 315 top
LED374  FC-B1010RGBT-HG  [LED-ARRAY-SMD_4P-L1.0-W1.0-TR-RD]  78.74 7.62 315 top
LED375  FC-B1010RGBT-HG  [LED-ARRAY-SMD_4P-L1.0-W1.0-TR-RD]  80.77 7.62 315 top
LED376  FC-B1010RGBT-HG  [LED-ARRAY-SMD_4P-L1.0-W1.0-TR-RD]  82.8 7.62 315 top
LED377  FC-B1010RGBT-HG  [LED-ARRAY-SMD_4P-L1.0-W1.0-TR-RD]  84.84 7.62 315 top
LED378  FC-B1010RGBT-HG  [LED-ARRAY-SMD_4P-L1.0-W1.0-TR-RD]  86.87 7.62 315 top
LED379  FC-B1010RGBT-HG  [LED-ARRAY-SMD_4P-L1.0-W1.0-TR-RD]  88.9 7.62 315 top
LED380  FC-B1010RGBT-HG  [LED-ARRAY-SMD_4P-L1.0-W1.0-TR-RD]  90.93 7.62 315 top
LED381  FC-B1010RGBT-HG  [LED-ARRAY-SMD_4P-L1.0-W1.0-TR-RD]  92.96 7.62 315 top
LED382  FC-B1010RGBT-HG  [LED-ARRAY-SMD_4P-L1.0-W1.0-TR-RD]  95 7.62 315 top
LED383  FC-B1010RGBT-HG  [LED-ARRAY-SMD_4P-L1.0-W1.0-TR-RD]  97.03 7.62 315 top
LED384  FC-B1010RGBT-HG  [LED-ARRAY-SMD_4P-L1.0-W1.0-TR-RD]  99.06 7.62 315 top
LED385  FC-B1010RGBT-HG  [LED-ARRAY-SMD_4P-L1.0-W1.0-TR-RD]  3.56 5.59 315 top
LED386  FC-B1010RGBT-HG  [LED-ARRAY-SMD_4P-L1.0-W1.0-TR-RD]  5.59 5.59 315 top
LED387  FC-B1010RGBT-HG  [LED-ARRAY-SMD_4P-L1.0-W1.0-TR-RD]  7.62 5.59 315 top
LED388  FC-B1010RGBT-HG  [LED-ARRAY-SMD_4P-L1.0-W1.0-TR-RD]  9.65 5.59 315 top
LED389  FC-B1010RGBT-HG  [LED-ARRAY-SMD_4P-L1.0-W1.0-TR-RD]  11.68 5.59 315 top
LED390  FC-B1010RGBT-HG  [LED-ARRAY-SMD_4P-L1.0-W1.0-TR-RD]  13.72 5.59 315 top
LED391  FC-B1010RGBT-HG  [LED-ARRAY-SMD_4P-L1.0-W1.0-TR-RD]  15.75 5.59 315 top
LED392  FC-B1010RGBT-HG  [LED-ARRAY-SMD_4P-L1.0-W1.0-TR-RD]  17.78 5.59 315 top
LED393  FC-B1010RGBT-HG  [LED-ARRAY-SMD_4P-L1.0-W1.0-TR-RD]  19.81 5.59 315 top
LED394  FC-B1010RGBT-HG  [LED-ARRAY-SMD_4P-L1.0-W1.0-TR-RD]  21.84 5.59 315 top
LED395  FC-B1010RGBT-HG  [LED-ARRAY-SMD_4P-L1.0-W1.0-TR-RD]  23.88 5.59 315 top
LED396  FC-B1010RGBT-HG  [LED-ARRAY-SMD_4P-L1.0-W1.0-TR-RD]  25.91 5.59 315 top
LED397  FC-B1010RGBT-HG  [LED-ARRAY-SMD_4P-L1.0-W1.0-TR-RD]  27.94 5.59 315 top
LED398  FC-B1010RGBT-HG  [LED-ARRAY-SMD_4P-L1.0-W1.0-TR-RD]  29.97 5.59 315 top
LED399  FC-B1010RGBT-HG  [LED-ARRAY-SMD_4P-L1.0-W1.0-TR-RD]  32 5.59 315 top
LED400  FC-B1010RGBT-HG  [LED-ARRAY-SMD_4P-L1.0-W1.0-TR-RD]  34.04 5.59 315 top
LED401  FC-B1010RGBT-HG  [LED-ARRAY-SMD_4P-L1.0-W1.0-TR-RD]  36.07 5.59 315 top
LED402  FC-B1010RGBT-HG  [LED-ARRAY-SMD_4P-L1.0-W1.0-TR-RD]  38.1 5.59 315 top
LED403  FC-B1010RGBT-HG  [LED-ARRAY-SMD_4P-L1.0-W1.0-TR-RD]  40.13 5.59 315 top
LED404  FC-B1010RGBT-HG  [LED-ARRAY-SMD_4P-L1.0-W1.0-TR-RD]  42.16 5.59 315 top
LED405  FC-B1010RGBT-HG  [LED-ARRAY-SMD_4P-L1.0-W1.0-TR-RD]  44.2 5.59 315 top
LED406  FC-B1010RGBT-HG  [LED-ARRAY-SMD_4P-L1.0-W1.0-TR-RD]  46.23 5.59 315 top
LED407  FC-B1010RGBT-HG  [LED-ARRAY-SMD_4P-L1.0-W1.0-TR-RD]  48.26 5.59 315 top
LED408  FC-B1010RGBT-HG  [LED-ARRAY-SMD_4P-L1.0-W1.0-TR-RD]  50.29 5.59 315 top
LED409  FC-B1010RGBT-HG  [LED-ARRAY-SMD_4P-L1.0-W1.0-TR-RD]  52.32 5.59 315 top
LED410  FC-B1010RGBT-HG  [LED-ARRAY-SMD_4P-L1.0-W1.0-TR-RD]  54.36 5.59 315 top
LED411  FC-B1010RGBT-HG  [LED-ARRAY-SMD_4P-L1.0-W1.0-TR-RD]  56.39 5.59 315 top
LED412  FC-B1010RGBT-HG  [LED-ARRAY-SMD_4P-L1.0-W1.0-TR-RD]  58.42 5.59 315 top
LED413  FC-B1010RGBT-HG  [LED-ARRAY-SMD_4P-L1.0-W1.0-TR-RD]  60.45 5.59 315 top
LED414  FC-B1010RGBT-HG  [LED-ARRAY-SMD_4P-L1.0-W1.0-TR-RD]  62.48 5.59 315 top
LED415  FC-B1010RGBT-HG  [LED-ARRAY-SMD_4P-L1.0-W1.0-TR-RD]  64.52 5.59 315 top
LED416  FC-B1010RGBT-HG  [LED-ARRAY-SMD_4P-L1.0-W1.0-TR-RD]  66.55 5.59 315 top
LED417  FC-B1010RGBT-HG  [LED-ARRAY-SMD_4P-L1.0-W1.0-TR-RD]  68.58 5.59 315 top
LED418  FC-B1010RGBT-HG  [LED-ARRAY-SMD_4P-L1.0-W1.0-TR-RD]  70.61 5.59 315 top
LED419  FC-B1010RGBT-HG  [LED-ARRAY-SMD_4P-L1.0-W1.0-TR-RD]  72.64 5.59 315 top
LED420  FC-B1010RGBT-HG  [LED-ARRAY-SMD_4P-L1.0-W1.0-TR-RD]  74.68 5.59 315 top
LED421  FC-B1010RGBT-HG  [LED-ARRAY-SMD_4P-L1.0-W1.0-TR-RD]  76.71 5.59 315 top
LED422  FC-B1010RGBT-HG  [LED-ARRAY-SMD_4P-L1.0-W1.0-TR-RD]  78.74 5.59 315 top
LED423  FC-B1010RGBT-HG  [LED-ARRAY-SMD_4P-L1.0-W1.0-TR-RD]  80.77 5.59 315 top
LED424  FC-B1010RGBT-HG  [LED-ARRAY-SMD_4P-L1.0-W1.0-TR-RD]  82.8 5.59 315 top
LED425  FC-B1010RGBT-HG  [LED-ARRAY-SMD_4P-L1.0-W1.0-TR-RD]  84.84 5.59 315 top
LED426  FC-B1010RGBT-HG  [LED-ARRAY-SMD_4P-L1.0-W1.0-TR-RD]  86.87 5.59 315 top
LED427  FC-B1010RGBT-HG  [LED-ARRAY-SMD_4P-L1.0-W1.0-TR-RD]  88.9 5.59 315 top
LED428  FC-B1010RGBT-HG  [LED-ARRAY-SMD_4P-L1.0-W1.0-TR-RD]  90.93 5.59 315 top
LED429  FC-B1010RGBT-HG  [LED-ARRAY-SMD_4P-L1.0-W1.0-TR-RD]  92.96 5.59 315 top
LED430  FC-B1010RGBT-HG  [LED-ARRAY-SMD_4P-L1.0-W1.0-TR-RD]  95 5.59 315 top
LED431  FC-B1010RGBT-HG  [LED-ARRAY-SMD_4P-L1.0-W1.0-TR-RD]  97.03 5.59 315 top
LED432  FC-B1010RGBT-HG  [LED-ARRAY-SMD_4P-L1.0-W1.0-TR-RD]  99.06 5.59 315 top
LED433  FC-B1010RGBT-HG  [LED-ARRAY-SMD_4P-L1.0-W1.0-TR-RD]  3.56 3.56 315 top
LED434  FC-B1010RGBT-HG  [LED-ARRAY-SMD_4P-L1.0-W1.0-TR-RD]  5.59 3.56 315 top
LED435  FC-B1010RGBT-HG  [LED-ARRAY-SMD_4P-L1.0-W1.0-TR-RD]  7.62 3.56 315 top
LED436  FC-B1010RGBT-HG  [LED-ARRAY-SMD_4P-L1.0-W1.0-TR-RD]  9.65 3.56 315 top
LED437  FC-B1010RGBT-HG  [LED-ARRAY-SMD_4P-L1.0-W1.0-TR-RD]  11.68 3.56 315 top
LED438  FC-B1010RGBT-HG  [LED-ARRAY-SMD_4P-L1.0-W1.0-TR-RD]  13.72 3.56 315 top
LED439  FC-B1010RGBT-HG  [LED-ARRAY-SMD_4P-L1.0-W1.0-TR-RD]  15.75 3.56 315 top
LED440  FC-B1010RGBT-HG  [LED-ARRAY-SMD_4P-L1.0-W1.0-TR-RD]  17.78 3.56 315 top
LED441  FC-B1010RGBT-HG  [LED-ARRAY-SMD_4P-L1.0-W1.0-TR-RD]  19.81 3.56 315 top
LED442  FC-B1010RGBT-HG  [LED-ARRAY-SMD_4P-L1.0-W1.0-TR-RD]  21.84 3.56 315 top
LED443  FC-B1010RGBT-HG  [LED-ARRAY-SMD_4P-L1.0-W1.0-TR-RD]  23.88 3.56 315 top
LED444  FC-B1010RGBT-HG  [LED-ARRAY-SMD_4P-L1.0-W1.0-TR-RD]  25.91 3.56 315 top
LED445  FC-B1010RGBT-HG  [LED-ARRAY-SMD_4P-L1.0-W1.0-TR-RD]  27.94 3.56 315 top
LED446  FC-B1010RGBT-HG  [LED-ARRAY-SMD_4P-L1.0-W1.0-TR-RD]  29.97 3.56 315 top
LED447  FC-B1010RGBT-HG  [LED-ARRAY-SMD_4P-L1.0-W1.0-TR-RD]  32 3.56 315 top
LED448  FC-B1010RGBT-HG  [LED-ARRAY-SMD_4P-L1.0-W1.0-TR-RD]  34.04 3.56 315 top
LED449  FC-B1010RGBT-HG  [LED-ARRAY-SMD_4P-L1.0-W1.0-TR-RD]  36.07 3.56 315 top
LED450  FC-B1010RGBT-HG  [LED-ARRAY-SMD_4P-L1.0-W1.0-TR-RD]  38.1 3.56 315 top
LED451  FC-B1010RGBT-HG  [LED-ARRAY-SMD_4P-L1.0-W1.0-TR-RD]  40.13 3.56 315 top
LED452  FC-B1010RGBT-HG  [LED-ARRAY-SMD_4P-L1.0-W1.0-TR-RD]  42.16 3.56 315 top
LED453  FC-B1010RGBT-HG  [LED-ARRAY-SMD_4P-L1.0-W1.0-TR-RD]  44.2 3.56 315 top
LED454  FC-B1010RGBT-HG  [LED-ARRAY-SMD_4P-L1.0-W1.0-TR-RD]  46.23 3.56 315 top
LED455  FC-B1010RGBT-HG  [LED-ARRAY-SMD_4P-L1.0-W1.0-TR-RD]  48.26 3.56 315 top
LED456  FC-B1010RGBT-HG  [LED-ARRAY-SMD_4P-L1.0-W1.0-TR-RD]  50.29 3.56 315 top
LED457  FC-B1010RGBT-HG  [LED-ARRAY-SMD_4P-L1.0-W1.0-TR-RD]  52.32 3.56 315 top
LED458  FC-B1010RGBT-HG  [LED-ARRAY-SMD_4P-L1.0-W1.0-TR-RD]  54.36 3.56 315 top
LED459  FC-B1010RGBT-HG  [LED-ARRAY-SMD_4P-L1.0-W1.0-TR-RD]  56.39 3.56 315 top
LED460  FC-B1010RGBT-HG  [LED-ARRAY-SMD_4P-L1.0-W1.0-TR-RD]  58.42 3.56 315 top
LED461  FC-B1010RGBT-HG  [LED-ARRAY-SMD_4P-L1.0-W1.0-TR-RD]  60.45 3.56 315 top
LED462  FC-B1010RGBT-HG  [LED-ARRAY-SMD_4P-L1.0-W1.0-TR-RD]  62.48 3.56 315 top
LED463  FC-B1010RGBT-HG  [LED-ARRAY-SMD_4P-L1.0-W1.0-TR-RD]  64.52 3.56 315 top
LED464  FC-B1010RGBT-HG  [LED-ARRAY-SMD_4P-L1.0-W1.0-TR-RD]  66.55 3.56 315 top
LED465  FC-B1010RGBT-HG  [LED-ARRAY-SMD_4P-L1.0-W1.0-TR-RD]  68.58 3.56 315 top
LED466  FC-B1010RGBT-HG  [LED-ARRAY-SMD_4P-L1.0-W1.0-TR-RD]  70.61 3.56 315 top
LED467  FC-B1010RGBT-HG  [LED-ARRAY-SMD_4P-L1.0-W1.0-TR-RD]  72.64 3.56 315 top
LED468  FC-B1010RGBT-HG  [LED-ARRAY-SMD_4P-L1.0-W1.0-TR-RD]  74.68 3.56 315 top
LED469  FC-B1010RGBT-HG  [LED-ARRAY-SMD_4P-L1.0-W1.0-TR-RD]  76.71 3.56 315 top
LED470  FC-B1010RGBT-HG  [LED-ARRAY-SMD_4P-L1.0-W1.0-TR-RD]  78.74 3.56 315 top
LED471  FC-B1010RGBT-HG  [LED-ARRAY-SMD_4P-L1.0-W1.0-TR-RD]  80.77 3.56 315 top
LED472  FC-B1010RGBT-HG  [LED-ARRAY-SMD_4P-L1.0-W1.0-TR-RD]  82.8 3.56 315 top
LED473  FC-B1010RGBT-HG  [LED-ARRAY-SMD_4P-L1.0-W1.0-TR-RD]  84.84 3.56 315 top
LED474  FC-B1010RGBT-HG  [LED-ARRAY-SMD_4P-L1.0-W1.0-TR-RD]  86.87 3.56 315 top
LED475  FC-B1010RGBT-HG  [LED-ARRAY-SMD_4P-L1.0-W1.0-TR-RD]  88.9 3.56 315 top
LED476  FC-B1010RGBT-HG  [LED-ARRAY-SMD_4P-L1.0-W1.0-TR-RD]  90.93 3.56 315 top
LED477  FC-B1010RGBT-HG  [LED-ARRAY-SMD_4P-L1.0-W1.0-TR-RD]  92.96 3.56 315 top
LED478  FC-B1010RGBT-HG  [LED-ARRAY-SMD_4P-L1.0-W1.0-TR-RD]  95 3.56 315 top
LED479  FC-B1010RGBT-HG  [LED-ARRAY-SMD_4P-L1.0-W1.0-TR-RD]  97.03 3.56 315 top
LED480  FC-B1010RGBT-HG  [LED-ARRAY-SMD_4P-L1.0-W1.0-TR-RD]  99.06 3.56 315 top
NOREF  -  [Pad_e705]  42.16 23.88 0 top
NOREF#2  -  [Pad_e738]  53.85 1.78 0 top
NOREF#3  -  [Pad_e695]  23.88 23.88 0 top
NOREF#4  -  [Pad_e698]  29.97 23.88 0 top
NOREF#5  -  [Pad_e718]  76.71 23.88 0 top
NOREF#6  -  [Pad_e709]  52.32 23.88 0 top
NOREF#7  -  [Pad_e760]  5.59 1.78 0 top
NOREF#8  -  [Pad_e727]  95 23.88 0 top
NOREF#9  -  [Pad_e743]  43.18 1.78 0 top
NOREF#10  -  [Pad_e745]  38.61 1.78 0 top
NOREF#11  -  [Pad_e687]  7.62 23.88 0 top
NOREF#12  -  [Pad_e713]  60.45 23.88 0 top
NOREF#13  -  [Pad_e693]  19.81 23.88 0 top
NOREF#14  -  [Pad_e712]  58.42 23.88 0 top
NOREF#15  -  [Pad_e729]  67.06 1.78 0 top
NOREF#16  -  [Pad_e694]  21.84 23.88 0 top
NOREF#17  -  [Pad_e759]  7.62 1.78 0 top
NOREF#18  -  [Pad_e747]  34.04 1.78 0 top
NOREF#19  -  [Pad_e752]  23.37 1.78 0 top
NOREF#20  -  [Pad_e721]  82.8 23.88 0 top
NOREF#21  -  [Pad_e724]  88.9 23.88 0 top
NOREF#22  -  [Pad_e740]  49.78 1.78 0 top
NOREF#23  -  [Pad_e689]  11.68 23.88 0 top
NOREF#24  -  [Pad_e746]  36.58 1.78 0 top
NOREF#25  -  [Pad_e744]  40.64 1.78 0 top
NOREF#26  -  [Pad_e700]  34.04 23.88 0 top
NOREF#27  -  [Pad_e755]  16.76 1.78 0 top
NOREF#28  -  [Pad_e696]  25.91 23.88 0 top
NOREF#29  -  [Pad_e706]  46.23 23.88 0 top
NOREF#30  -  [Pad_e725]  90.93 23.88 0 top
NOREF#31  -  [Pad_e734]  62.99 1.78 0 top
NOREF#32  -  [Pad_e686]  5.59 23.88 0 top
NOREF#33  -  [Pad_e707]  48.26 23.88 0 top
NOREF#34  -  [Pad_e739]  51.82 1.78 0 top
NOREF#35  -  [Pad_e697]  27.94 23.88 0 top
NOREF#36  -  [Pad_e758]  10.16 1.78 0 top
NOREF#37  -  [Pad_e741]  47.24 1.78 0 top
NOREF#38  -  [Pad_e749]  29.97 1.78 0 top
NOREF#39  -  [Pad_e684]  3.56 23.88 0 top
NOREF#40  -  [Pad_e716]  72.64 23.88 0 top
NOREF#41  -  [Pad_e704]  44.2 23.88 0 top
NOREF#42  -  [Pad_e756]  14.22 1.78 0 top
NOREF#43  -  [Pad_e708]  50.29 23.88 0 top
NOREF#44  -  [Pad_e733]  65.02 1.78 0 top
NOREF#45  -  [Pad_e701]  36.07 23.88 0 top
NOREF#46  -  [Pad_e731]  66.55 23.88 0 top
NOREF#47  -  [Pad_e685]  99.06 23.88 0 top
NOREF#48  -  [Pad_e735]  60.45 1.78 0 top
NOREF#49  -  [Pad_e723]  86.87 23.88 0 top
NOREF#50  -  [Pad_e691]  15.75 23.88 0 top
NOREF#51  -  [Pad_e722]  84.84 23.88 0 top
NOREF#52  -  [Pad_e742]  45.21 1.78 0 top
NOREF#53  -  [Pad_e728]  97.03 23.88 0 top
NOREF#54  -  [Pad_e736]  58.42 1.78 0 top
NOREF#55  -  [Pad_e692]  17.78 23.88 0 top
NOREF#56  -  [Pad_e751]  25.4 1.78 0 top
NOREF#57  -  [Pad_e761]  3.56 1.78 0 top
NOREF#58  -  [Pad_e699]  32 23.88 0 top
NOREF#59  -  [Pad_e753]  20.83 1.78 0 top
NOREF#60  -  [Pad_e719]  78.74 23.88 0 top
NOREF#61  -  [Pad_e688]  9.65 23.88 0 top
NOREF#62  -  [Pad_e757]  12.19 1.78 0 top
NOREF#63  -  [Pad_e703]  40.13 23.88 0 top
NOREF#64  -  [Pad_e737]  56.39 1.78 0 top
NOREF#65  -  [Pad_e750]  27.43 1.78 0 top
NOREF#66  -  [Pad_e732]  68.58 23.88 0 top
NOREF#67  -  [Pad_e710]  54.36 23.88 0 top
NOREF#68  -  [Pad_e717]  74.68 23.88 0 top
NOREF#69  -  [Pad_e730]  64.52 23.88 0 top
NOREF#70  -  [Pad_e715]  70.61 23.88 0 top
NOREF#71  -  [Pad_e726]  92.96 23.88 0 top
NOREF#72  -  [Pad_e690]  13.72 23.88 0 top
NOREF#73  -  [Pad_e702]  38.1 23.88 0 top
NOREF#74  -  [Pad_e711]  56.39 23.88 0 top
NOREF#75  -  [Pad_e720]  80.77 23.88 0 top
NOREF#76  -  [Pad_e714]  62.48 23.88 0 top
NOREF#77  -  [Pad_e748]  32 1.78 0 top
NOREF#78  -  [Pad_e754]  18.8 1.78 0 top

## Footprints (pads in the part's own frame, mm; a bottom-side part is the same pattern mirrored in y, then rotated)
LED-ARRAY-SMD_4P-L1.0-W1.0-TR-RD
  rect 0.3x0.3 smd: 1(0.35,0.35) 2(0.35,-0.35) 3(-0.35,-0.35) 4(-0.35,0.35)
Pad_e684
  rect 1.5x1.5 hole 0.914: 1(0,0)
Pad_e685
  rect 1.5x1.5 hole 0.914: 1(0,0)
Pad_e686
  rect 1.5x1.5 hole 0.914: 1(0,0)
Pad_e687
  rect 1.5x1.5 hole 0.914: 1(0,0)
Pad_e688
  rect 1.5x1.5 hole 0.914: 1(0,0)
Pad_e689
  rect 1.5x1.5 hole 0.914: 1(0,0)
Pad_e690
  rect 1.5x1.5 hole 0.914: 1(0,0)
Pad_e691
  rect 1.5x1.5 hole 0.914: 1(0,0)
Pad_e692
  rect 1.5x1.5 hole 0.914: 1(0,0)
Pad_e693
  rect 1.5x1.5 hole 0.914: 1(0,0)
Pad_e694
  rect 1.5x1.5 hole 0.914: 1(0,0)
Pad_e695
  rect 1.5x1.5 hole 0.914: 1(0,0)
Pad_e696
  rect 1.5x1.5 hole 0.914: 1(0,0)
Pad_e697
  rect 1.5x1.5 hole 0.914: 1(0,0)
Pad_e698
  rect 1.5x1.5 hole 0.914: 1(0,0)
Pad_e699
  rect 1.5x1.5 hole 0.914: 1(0,0)
Pad_e700
  rect 1.5x1.5 hole 0.914: 1(0,0)
Pad_e701
  rect 1.5x1.5 hole 0.914: 1(0,0)
Pad_e702
  rect 1.5x1.5 hole 0.914: 1(0,0)
Pad_e703
  rect 1.5x1.5 hole 0.914: 1(0,0)
Pad_e704
  rect 1.5x1.5 hole 0.914: 1(0,0)
Pad_e705
  rect 1.5x1.5 hole 0.914: 1(0,0)
Pad_e706
  rect 1.5x1.5 hole 0.914: 1(0,0)
Pad_e707
  rect 1.5x1.5 hole 0.914: 1(0,0)
Pad_e708
  rect 1.5x1.5 hole 0.914: 1(0,0)
Pad_e709
  rect 1.5x1.5 hole 0.914: 1(0,0)
Pad_e710
  rect 1.5x1.5 hole 0.914: 1(0,0)
Pad_e711
  rect 1.5x1.5 hole 0.914: 1(0,0)
Pad_e712
  rect 1.5x1.5 hole 0.914: 1(0,0)
Pad_e713
  rect 1.5x1.5 hole 0.914: 1(0,0)
Pad_e714
  rect 1.5x1.5 hole 0.914: 1(0,0)
Pad_e715
  rect 1.5x1.5 hole 0.914: 1(0,0)
Pad_e716
  rect 1.5x1.5 hole 0.914: 1(0,0)
Pad_e717
  rect 1.5x1.5 hole 0.914: 1(0,0)
Pad_e718
  rect 1.5x1.5 hole 0.914: 1(0,0)
Pad_e719
  rect 1.5x1.5 hole 0.914: 1(0,0)
Pad_e720
  rect 1.5x1.5 hole 0.914: 1(0,0)
Pad_e721
  rect 1.5x1.5 hole 0.914: 1(0,0)
Pad_e722
  rect 1.5x1.5 hole 0.914: 1(0,0)
Pad_e723
  rect 1.5x1.5 hole 0.914: 1(0,0)
Pad_e724
  rect 1.5x1.5 hole 0.914: 1(0,0)
Pad_e725
  rect 1.5x1.5 hole 0.914: 1(0,0)
Pad_e726
  rect 1.5x1.5 hole 0.914: 1(0,0)
Pad_e727
  rect 1.5x1.5 hole 0.914: 1(0,0)
Pad_e728
  rect 1.5x1.5 hole 0.914: 1(0,0)
Pad_e729
  rect 1.5x1.5 hole 0.914: 1(0,0)
Pad_e730
  rect 1.5x1.5 hole 0.914: 1(0,0)
Pad_e731
  rect 1.5x1.5 hole 0.914: 1(0,0)
Pad_e732
  rect 1.5x1.5 hole 0.914: 1(0,0)
Pad_e733
  rect 1.5x1.5 hole 0.914: 1(0,0)
Pad_e734
  rect 1.5x1.5 hole 0.914: 1(0,0)
Pad_e735
  rect 1.5x1.5 hole 0.914: 1(0,0)
Pad_e736
  rect 1.5x1.5 hole 0.914: 1(0,0)
Pad_e737
  rect 1.5x1.5 hole 0.914: 1(0,0)
Pad_e738
  rect 1.5x1.5 hole 0.914: 1(0,0)
Pad_e739
  rect 1.5x1.5 hole 0.914: 1(0,0)
Pad_e740
  rect 1.5x1.5 hole 0.914: 1(0,0)
Pad_e741
  rect 1.5x1.5 hole 0.914: 1(0,0)
Pad_e742
  rect 1.5x1.5 hole 0.914: 1(0,0)
Pad_e743
  rect 1.5x1.5 hole 0.914: 1(0,0)
Pad_e744
  rect 1.5x1.5 hole 0.914: 1(0,0)
Pad_e745
  rect 1.5x1.5 hole 0.914: 1(0,0)
Pad_e746
  rect 1.5x1.5 hole 0.914: 1(0,0)
Pad_e747
  rect 1.5x1.5 hole 0.914: 1(0,0)
Pad_e748
  rect 1.5x1.5 hole 0.914: 1(0,0)
Pad_e749
  rect 1.5x1.5 hole 0.914: 1(0,0)
Pad_e750
  rect 1.5x1.5 hole 0.914: 1(0,0)
Pad_e751
  rect 1.5x1.5 hole 0.914: 1(0,0)
Pad_e752
  rect 1.5x1.5 hole 0.914: 1(0,0)
Pad_e753
  rect 1.5x1.5 hole 0.914: 1(0,0)
Pad_e754
  rect 1.5x1.5 hole 0.914: 1(0,0)
Pad_e755
  rect 1.5x1.5 hole 0.914: 1(0,0)
Pad_e756
  rect 1.5x1.5 hole 0.914: 1(0,0)
Pad_e757
  rect 1.5x1.5 hole 0.914: 1(0,0)
Pad_e758
  rect 1.5x1.5 hole 0.914: 1(0,0)
Pad_e759
  rect 1.5x1.5 hole 0.914: 1(0,0)
Pad_e760
  rect 1.5x1.5 hole 0.914: 1(0,0)
Pad_e761
  rect 1.5x1.5 hole 0.914: 1(0,0)

## Nets
B0: LED1.2 LED2.2 LED3.2 LED4.2 LED5.2 LED6.2 LED7.2 LED8.2 LED9.2 LED10.2 LED11.2 LED12.2 LED13.2 LED14.2 LED15.2 LED16.2 LED17.2 LED18.2 LED19.2 LED20.2 LED21.2 LED22.2 LED23.2 LED24.2 LED25.2 LED26.2 LED27.2 LED28.2 LED29.2 LED30.2 LED31.2 LED32.2 LED33.2 LED34.2 LED35.2 LED36.2 LED37.2 LED38.2 LED39.2 LED40.2 LED41.2 LED42.2 LED43.2 LED44.2 LED45.2 LED46.2 LED47.2 LED48.2 NOREF#17.1
B1: LED49.2 LED50.2 LED51.2 LED52.2 LED53.2 LED54.2 LED55.2 LED56.2 LED57.2 LED58.2 LED59.2 LED60.2 LED61.2 LED62.2 LED63.2 LED64.2 LED65.2 LED66.2 LED67.2 LED68.2 LED69.2 LED70.2 LED71.2 LED72.2 LED73.2 LED74.2 LED75.2 LED76.2 LED77.2 LED78.2 LED79.2 LED80.2 LED81.2 LED82.2 LED83.2 LED84.2 LED85.2 LED86.2 LED87.2 LED88.2 LED89.2 LED90.2 LED91.2 LED92.2 LED93.2 LED94.2 LED95.2 LED96.2 NOREF#42.1
B2: LED97.2 LED98.2 LED99.2 LED100.2 LED101.2 LED102.2 LED103.2 LED104.2 LED105.2 LED106.2 LED107.2 LED108.2 LED109.2 LED110.2 LED111.2 LED112.2 LED113.2 LED114.2 LED115.2 LED116.2 LED117.2 LED118.2 LED119.2 LED120.2 LED121.2 LED122.2 LED123.2 LED124.2 LED125.2 LED126.2 LED127.2 LED128.2 LED129.2 LED130.2 LED131.2 LED132.2 LED133.2 LED134.2 LED135.2 LED136.2 LED137.2 LED138.2 LED139.2 LED140.2 LED141.2 LED142.2 LED143.2 LED144.2 NOREF#59.1
B3: LED145.2 LED146.2 LED147.2 LED148.2 LED149.2 LED150.2 LED151.2 LED152.2 LED153.2 LED154.2 LED155.2 LED156.2 LED157.2 LED158.2 LED159.2 LED160.2 LED161.2 LED162.2 LED163.2 LED164.2 LED165.2 LED166.2 LED167.2 LED168.2 LED169.2 LED170.2 LED171.2 LED172.2 LED173.2 LED174.2 LED175.2 LED176.2 LED177.2 LED178.2 LED179.2 LED180.2 LED181.2 LED182.2 LED183.2 LED184.2 LED185.2 LED186.2 LED187.2 LED188.2 LED189.2 LED190.2 LED191.2 LED192.2 NOREF#65.1
B4: LED193.2 LED194.2 LED195.2 LED196.2 LED197.2 LED198.2 LED199.2 LED200.2 LED201.2 LED202.2 LED203.2 LED204.2 LED205.2 LED206.2 LED207.2 LED208.2 LED209.2 LED210.2 LED211.2 LED212.2 LED213.2 LED214.2 LED215.2 LED216.2 LED217.2 LED218.2 LED219.2 LED220.2 LED221.2 LED222.2 LED223.2 LED224.2 LED225.2 LED226.2 LED227.2 LED228.2 LED229.2 LED230.2 LED231.2 LED232.2 LED233.2 LED234.2 LED235.2 LED236.2 LED237.2 LED238.2 LED239.2 LED240.2 NOREF#18.1
B5: LED241.2 LED242.2 LED243.2 LED244.2 LED245.2 LED246.2 LED247.2 LED248.2 LED249.2 LED250.2 LED251.2 LED252.2 LED253.2 LED254.2 LED255.2 LED256.2 LED257.2 LED258.2 LED259.2 LED260.2 LED261.2 LED262.2 LED263.2 LED264.2 LED265.2 LED266.2 LED267.2 LED268.2 LED269.2 LED270.2 LED271.2 LED272.2 LED273.2 LED274.2 LED275.2 LED276.2 LED277.2 LED278.2 LED279.2 LED280.2 LED281.2 LED282.2 LED283.2 LED284.2 LED285.2 LED286.2 LED287.2 LED288.2 NOREF#25.1
B6: LED289.2 LED290.2 LED291.2 LED292.2 LED293.2 LED294.2 LED295.2 LED296.2 LED297.2 LED298.2 LED299.2 LED300.2 LED301.2 LED302.2 LED303.2 LED304.2 LED305.2 LED306.2 LED307.2 LED308.2 LED309.2 LED310.2 LED311.2 LED312.2 LED313.2 LED314.2 LED315.2 LED316.2 LED317.2 LED318.2 LED319.2 LED320.2 LED321.2 LED322.2 LED323.2 LED324.2 LED325.2 LED326.2 LED327.2 LED328.2 LED329.2 LED330.2 LED331.2 LED332.2 LED333.2 LED334.2 LED335.2 LED336.2 NOREF#37.1
